# Altium schematic sheet Block Diagram.SchDoc: TFT PMOD
size Tabloid; Date: 7/9/2017; DrawnBy: Dave McCoy; Engineer: Dave McCoy; DocumentNumber: 1; Revision: B; SheetNumber: 1; SheetTotal: 4
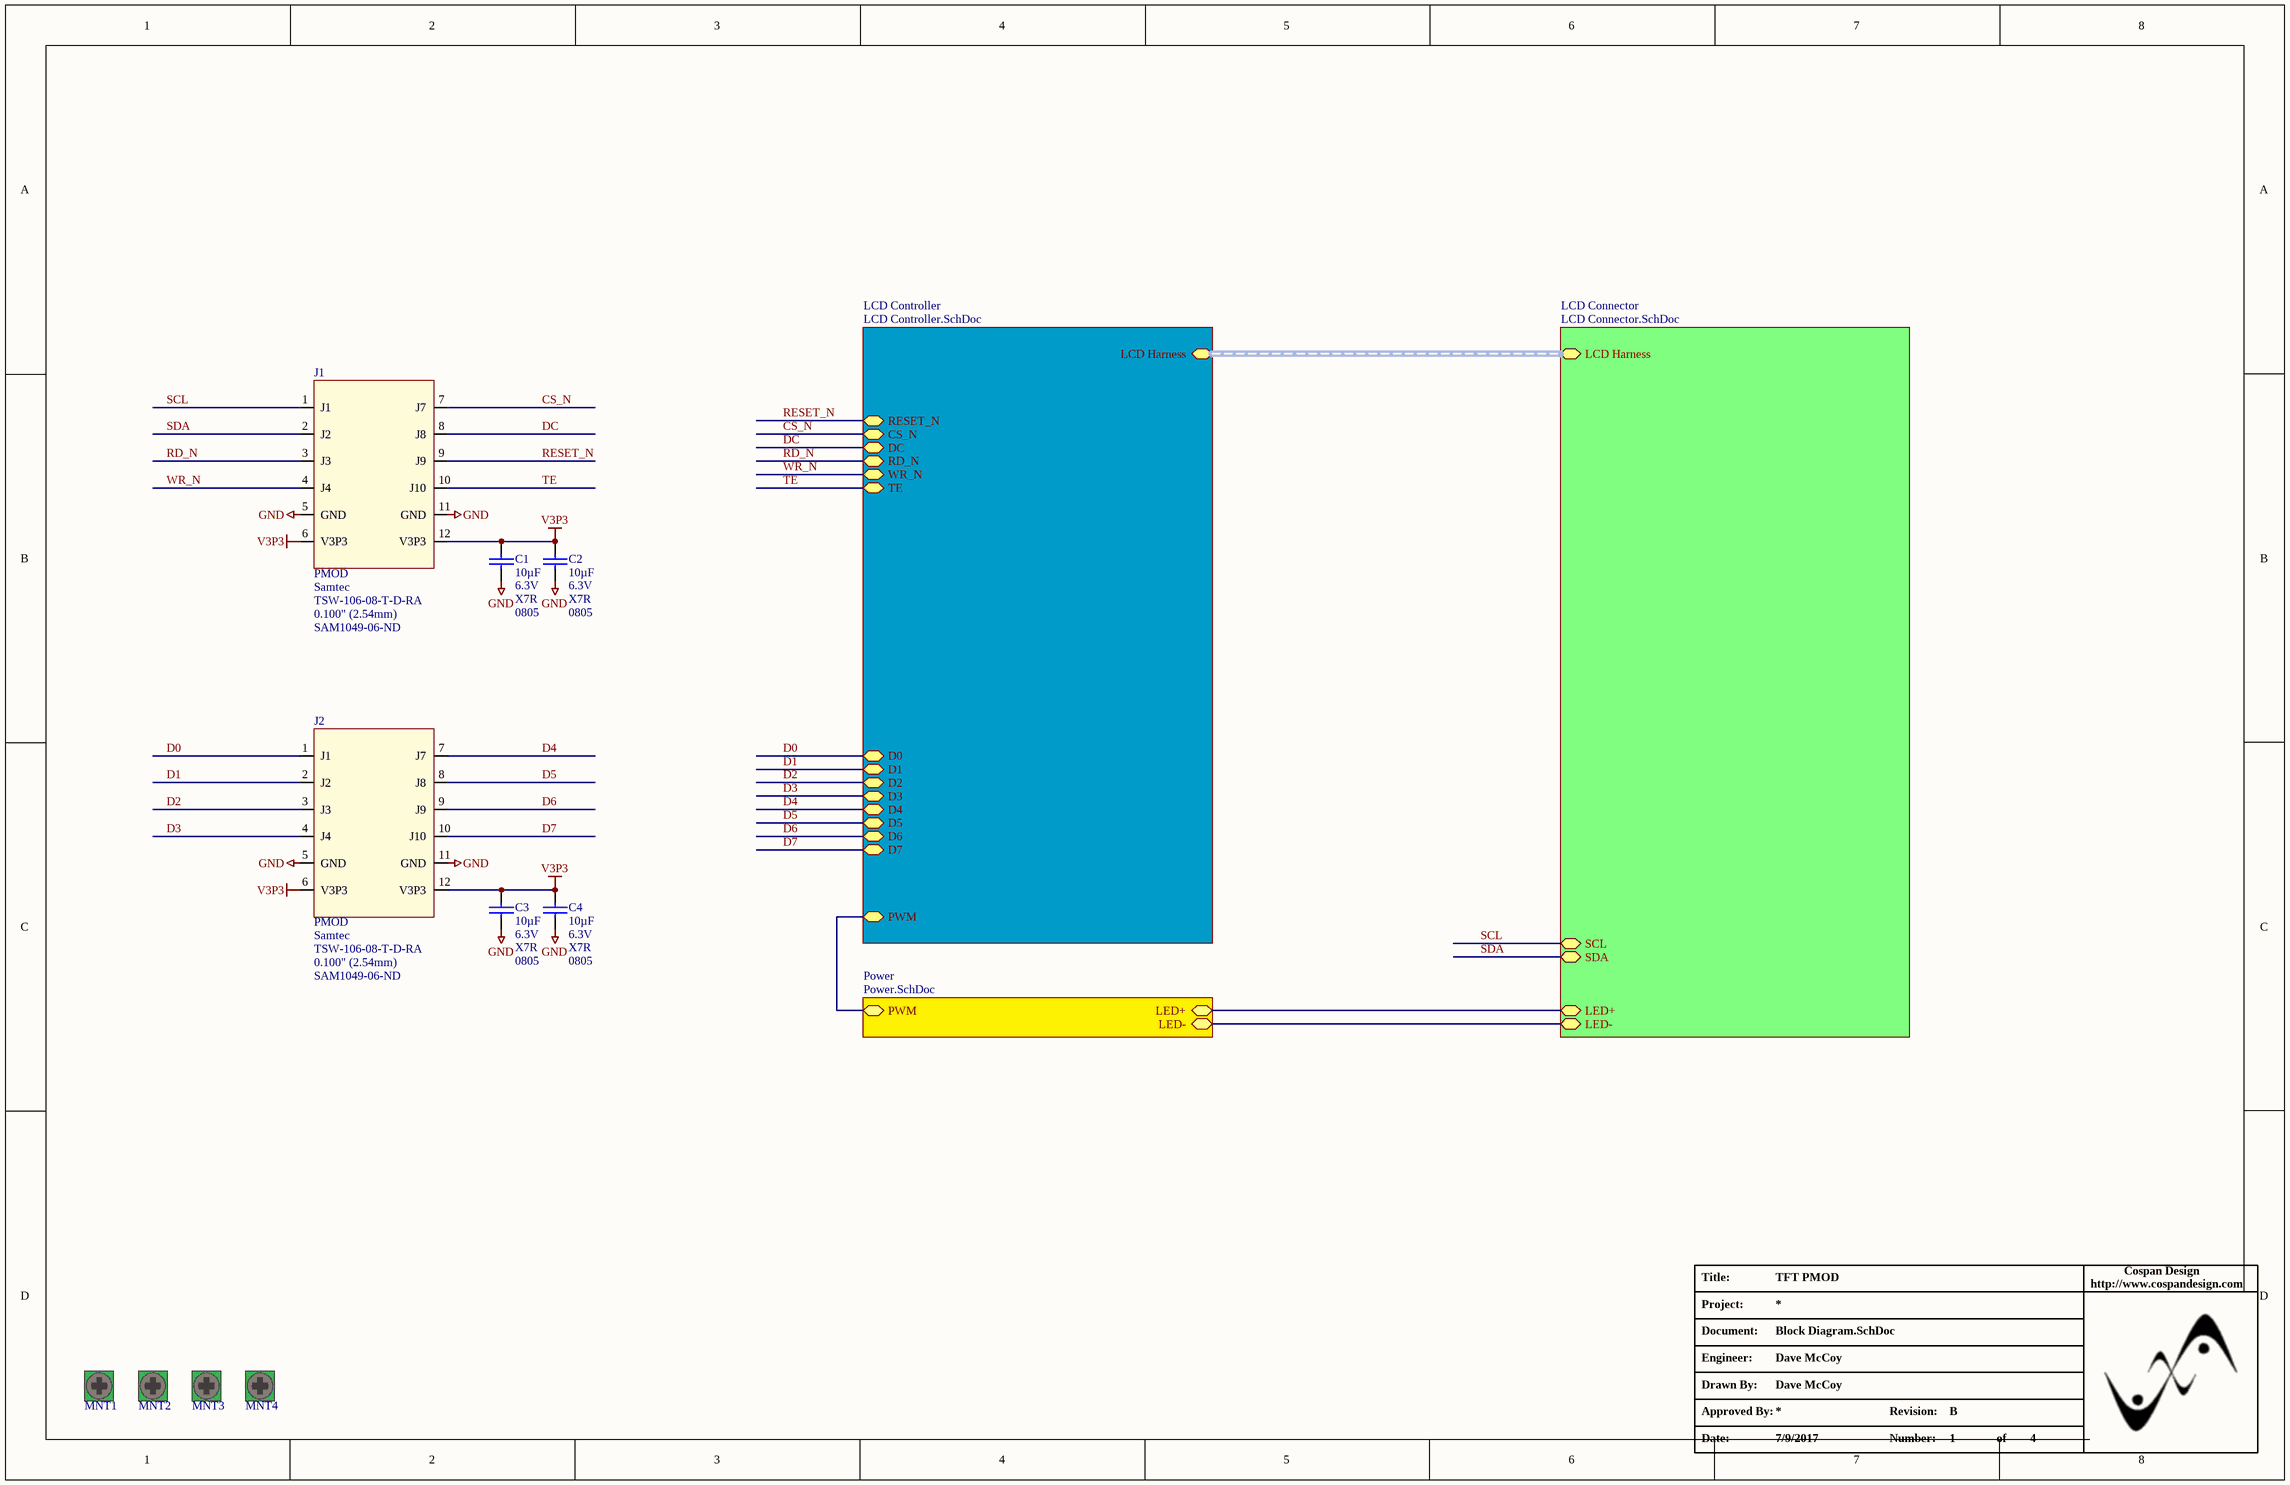
[diagram p0: Block Diagram.SchDoc]

## Parts
C1  Capacitance: 10µF  Voltage - Rated: 6.3V  Temperature Coefficient: X7R  Package / Case: 0805  [C_ERA-0805]  (hidden comment: 10uF)
C2  Capacitance: 10µF  Voltage - Rated: 6.3V  Temperature Coefficient: X7R  Package / Case: 0805  [C_ERA-0805]  (hidden comment: 10uF)
C3  Capacitance: 10µF  Voltage - Rated: 6.3V  Temperature Coefficient: X7R  Package / Case: 0805  [C_ERA-0805]  (hidden comment: 10uF)
C4  Capacitance: 10µF  Voltage - Rated: 6.3V  Temperature Coefficient: X7R  Package / Case: 0805  [C_ERA-0805]  (hidden comment: 10uF)
J1  PMOD  Manufacturer: Samtec  Manufacturer Part Number: TSW-106-08-T-D-RA  Pitch: 0.100" (2.54mm)  Supplier Part Number 1: SAM1049-06-ND  [PMOD PERIPHERAL]
J2  PMOD  Manufacturer: Samtec  Manufacturer Part Number: TSW-106-08-T-D-RA  Pitch: 0.100" (2.54mm)  Supplier Part Number 1: SAM1049-06-ND  [PMOD PERIPHERAL]
MNT1  Mounting Hole  [MNT_4-40]  (value not drawn)  (no BOM)
MNT2  Mounting Hole  [MNT_4-40]  (value not drawn)  (no BOM)
MNT3  Mounting Hole  [MNT_4-40]  (value not drawn)  (no BOM)
MNT4  Mounting Hole  [MNT_4-40]  (value not drawn)  (no BOM)

## Sub-sheets
LCD Connector = LCD Connector.SchDoc: LCD Harness (harness LCD Harness), LED+, LED-, SCL, SDA
LCD Controller = LCD Controller.SchDoc: PWM, LCD Harness (harness LCD Harness), RESET_N, CS_N, DC, RD_N, WR_N, TE, D0, D1, D2, D3, D4, D5, D6, D7
Power = Power.SchDoc: PWM, LED+, LED-

## Nets
GND: C1.1 C2.1 C3.1 C4.1 J1.5(GND) J1.11(GND) J2.5(GND) J2.11(GND)
V3P3: C1.2 C2.2 C3.2 C4.2 J1.6(V3P3) J1.12(V3P3) J2.6(V3P3) J2.12(V3P3)
CS_N: J1.7(J7) ; sheet LCD Controller/CS_N
D0: J2.1(J1) ; sheet LCD Controller/D0
D1: J2.2(J2) ; sheet LCD Controller/D1
D2: J2.3(J3) ; sheet LCD Controller/D2
D3: J2.4(J4) ; sheet LCD Controller/D3
D4: J2.7(J7) ; sheet LCD Controller/D4
D5: J2.8(J8) ; sheet LCD Controller/D5
D6: J2.9(J9) ; sheet LCD Controller/D6
D7: J2.10(J10) ; sheet LCD Controller/D7
DC: J1.8(J8) ; sheet LCD Controller/DC
RD_N: J1.3(J3) ; sheet LCD Controller/RD_N
RESET_N: J1.9(J9) ; sheet LCD Controller/RESET_N
SCL: J1.1(J1) ; sheet LCD Connector/SCL
SDA: J1.2(J2) ; sheet LCD Connector/SDA
TE: J1.10(J10) ; sheet LCD Controller/TE
WR_N: J1.4(J4) ; sheet LCD Controller/WR_N
(unnamed): sheet LCD Controller/PWM, sheet Power/PWM
(unnamed): sheet LCD Connector/LED+, sheet Power/LED+
(unnamed): sheet LCD Connector/LED-, sheet Power/LED-

## Buses and harness runs
harness sheet LCD Connector/LCD Harness = sheet LCD Controller/LCD Harness

## Notes on the sheet
- Title:
- http://www.cospandesign.com
- Cospan Design
- Project:
- Document:
- Engineer:
- Drawn By:
- Approved By:
- Revision:
- Date:
- Number:
- of

## Library data of the parts
C1-C4 = C_0805_10UF_6.3V: CAP CER 10UF 6.3V X7R 10% 0805; Manufacturer: Taiyo Yuden; Manufacturer Part Number: JMK212BJ106KD-T; Supplier 1: Digi-Key; RoHS: RoHS Compliant; Category: Capacitors; Stock 1: 94004; Pricing 1: 1=0.19, 10=0.132, 50=0.08, 100=0.0672, 250=0.0544, 500=0.048, 1000=0.0408 (USD); Tolerance: ±10%; Mounting Type: Surface Mount, MLCC; Operating Temperature: -55°C ~ 85°C; Applications: General Purpose; Ratings: -; Size / Dimension: 0.079" L x 0.049" W (2.00mm x 1.25mm); Height - Seated (Max): -; Thickness (Max): 0.037" (0.95mm); Lead Spacing: -; Features: -; Packaging: Cut Tape (CT); Lead Style: -; ComponentLink1URL: http://www.yuden.co.jp/productdata/catalog/en/mlcc01_e.pdf; ComponentLink1Description: http://www.yuden.co.jp/productdata/catalog/en/mlcc01_e.pdf; Supplier Part Number 1: 587-1304-1-ND; COST_1: *; COST_100: *; COST_1000: *; MANF1: *; MANF1_PN: *; MANF2: *; MANF2_PN: *; MANF3: *; MANF3_PN: *; VENDOR1: *; VENDOR1_PN: *
J1 J2 = J_PMOD_PERIPH: CONN HEADER 12PS .100 DL R/A TIN; Connector Type: Header, Unshrouded; Number of Positions: 12; Number of Positions Loaded: All; Supplier 1: Digi-Key; RoHS: RoHS Compliant; Category: Connectors, Interconnects; Stock 1: 0; Pricing 1: 1=1.4, 10=1.252, 100=1.0309, 500=0.81492, 1000=0.69955, 5000=0.63818, 10000=0.61364 (USD); Packaging: Bulk; Contact Type: Male Pin; Number of Rows: 2; Row Spacing: 0.100" (2.54mm); Contact Mating Length: 0.230" (5.84mm); Mounting Type: Through Hole, Right Angle; Termination: Solder; Fastening Type: -; Features: -; Contact Finish: Tin; Contact Finish Thickness: -; Color: Black; ComponentLink1URL: http://www.samtec.com/documents/webfiles/cpdf/TSW-XXX-XX-XXX-X-XX-XXX-MKT.pdf; ComponentLink1Description: http://www.samtec.com/documents/webfiles/cpdf/TSW-XXX-XX-XXX-X-XX-XXX-MKT.pdf
MNT1-MNT4 = MNT_440_HOLE